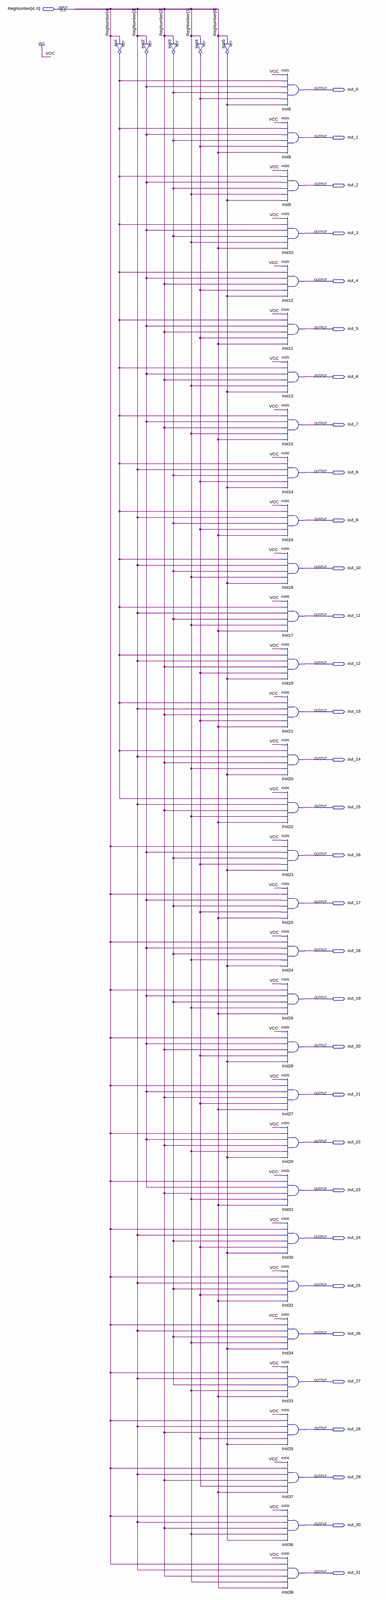
[diagram p0: schematic sheet, whole]
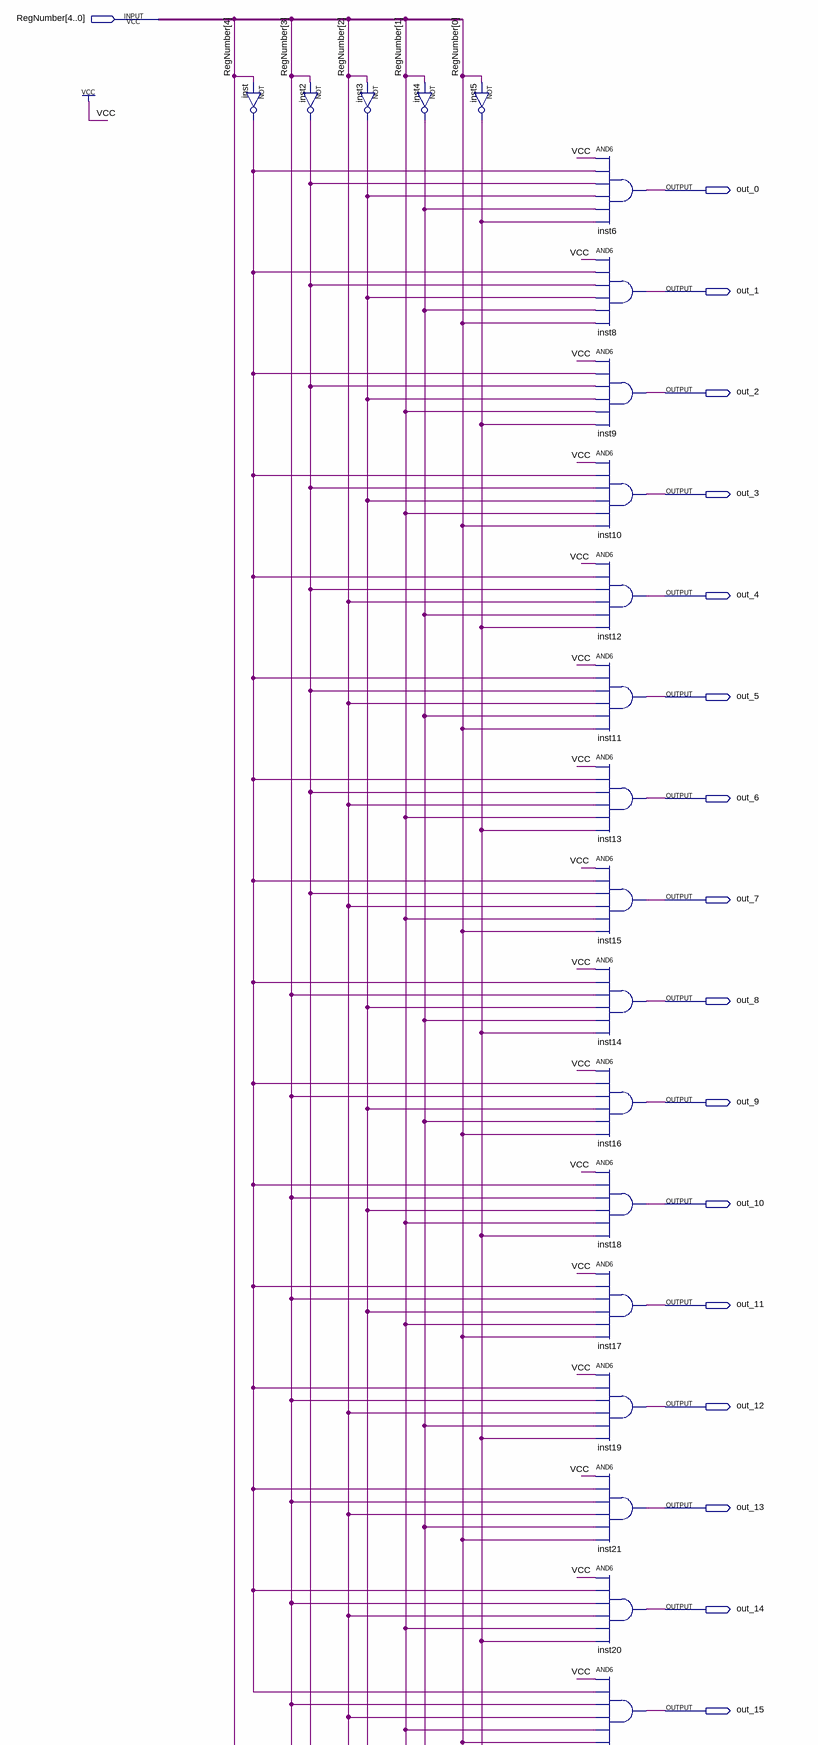
[diagram p1: schematic sheet, upper part]
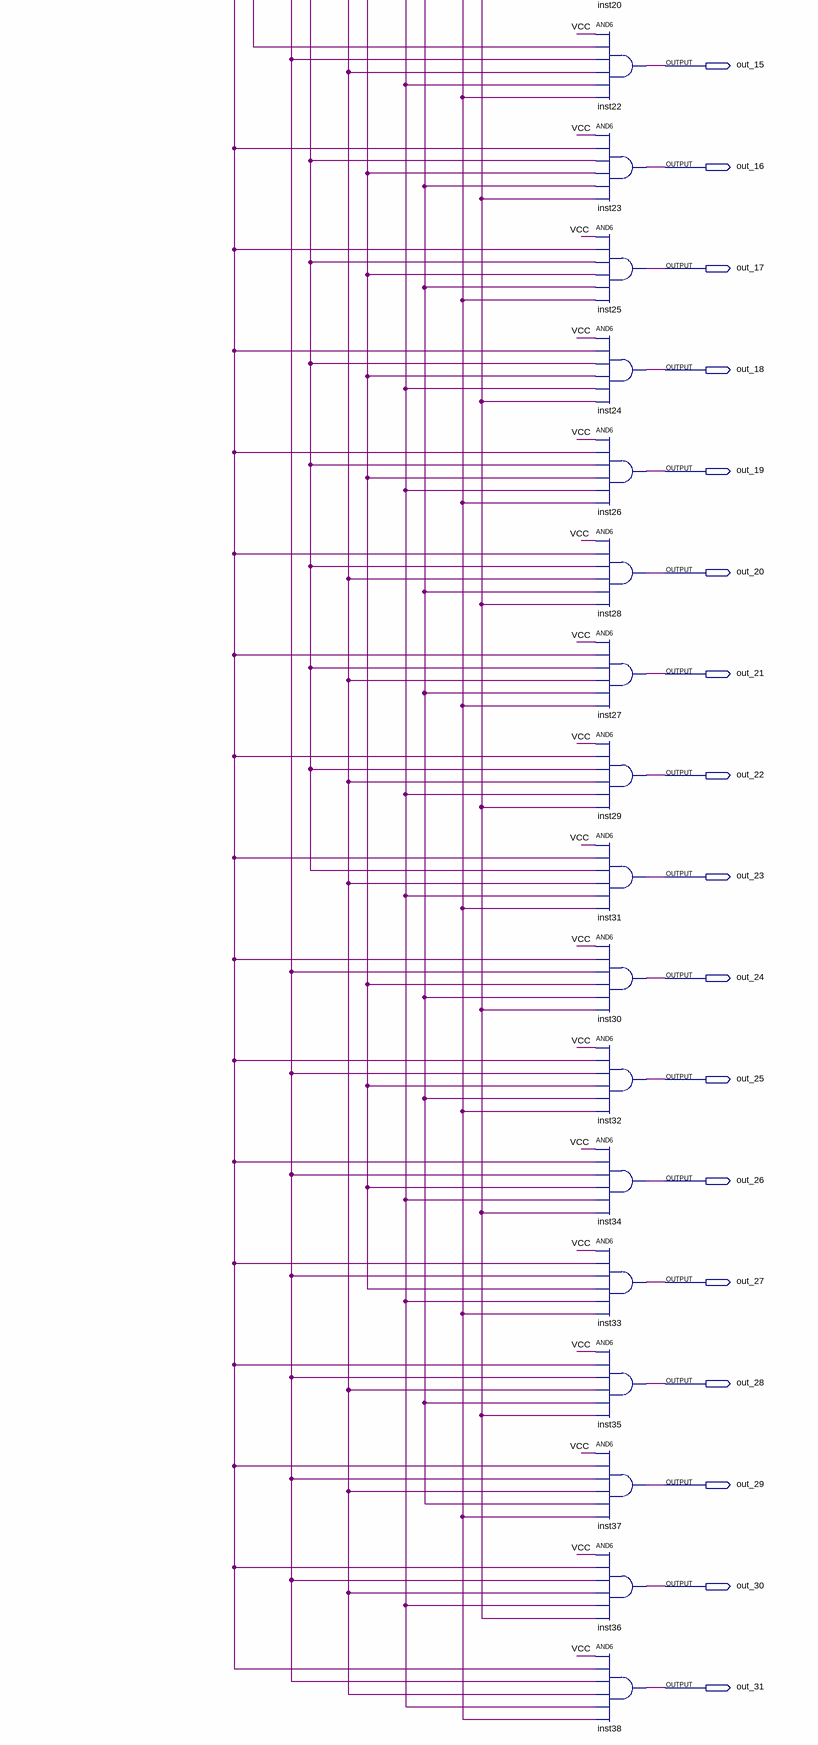
[diagram p2: schematic sheet, lower part]
// Quartus schematic Decoder_5_to_32.bdf as structural Verilog: 37 symbols, 33 pins
module Decoder_5_to_32 (
  input  [4:0] RegNumber,
  output out_0,
  output out_1,
  output out_2,
  output out_3,
  output out_4,
  output out_5,
  output out_6,
  output out_7,
  output out_8,
  output out_9,
  output out_10,
  output out_11,
  output out_12,
  output out_13,
  output out_14,
  output out_15,
  output out_16,
  output out_17,
  output out_18,
  output out_19,
  output out_20,
  output out_21,
  output out_22,
  output out_23,
  output out_24,
  output out_25,
  output out_26,
  output out_27,
  output out_28,
  output out_29,
  output out_30,
  output out_31
);

  wire inst2_out, inst3_out, inst4_out, inst5_out, inst_out;

  not inst (inst_out, RegNumber[4]);
  not inst2 (inst2_out, RegNumber[3]);
  not inst3 (inst3_out, RegNumber[2]);
  not inst4 (inst4_out, RegNumber[1]);
  not inst5 (inst5_out, RegNumber[0]);
  and inst6 (out_0, 1'b1, inst_out, inst2_out, inst3_out, inst4_out, inst5_out);
  and inst8 (out_1, 1'b1, inst_out, inst2_out, inst3_out, inst4_out, RegNumber[0]);
  and inst9 (out_2, 1'b1, inst_out, inst2_out, inst3_out, RegNumber[1], inst5_out);
  and inst10 (out_3, 1'b1, inst_out, inst2_out, inst3_out, RegNumber[1], RegNumber[0]);
  and inst12 (out_4, 1'b1, inst_out, inst2_out, RegNumber[2], inst4_out, inst5_out);
  and inst11 (out_5, 1'b1, inst_out, inst2_out, RegNumber[2], inst4_out, RegNumber[0]);
  and inst13 (out_6, 1'b1, inst_out, inst2_out, RegNumber[2], RegNumber[1], inst5_out);
  and inst15 (out_7, 1'b1, inst_out, inst2_out, RegNumber[2], RegNumber[1], RegNumber[0]);
  and inst14 (out_8, 1'b1, inst_out, RegNumber[3], inst3_out, inst4_out, inst5_out);
  and inst16 (out_9, 1'b1, inst_out, RegNumber[3], inst3_out, inst4_out, RegNumber[0]);
  and inst18 (out_10, 1'b1, inst_out, RegNumber[3], inst3_out, RegNumber[1], inst5_out);
  and inst17 (out_11, 1'b1, inst_out, RegNumber[3], inst3_out, RegNumber[1], RegNumber[0]);
  and inst19 (out_12, 1'b1, inst_out, RegNumber[3], RegNumber[2], inst4_out, inst5_out);
  and inst21 (out_13, 1'b1, inst_out, RegNumber[3], RegNumber[2], inst4_out, RegNumber[0]);
  and inst20 (out_14, 1'b1, inst_out, RegNumber[3], RegNumber[2], RegNumber[1], inst5_out);
  and inst22 (out_15, 1'b1, inst_out, RegNumber[3], RegNumber[2], RegNumber[1], RegNumber[0]);
  and inst23 (out_16, 1'b1, RegNumber[4], inst2_out, inst3_out, inst4_out, inst5_out);
  and inst25 (out_17, 1'b1, RegNumber[4], inst2_out, inst3_out, inst4_out, RegNumber[0]);
  and inst24 (out_18, 1'b1, RegNumber[4], inst2_out, inst3_out, RegNumber[1], inst5_out);
  and inst26 (out_19, 1'b1, RegNumber[4], inst2_out, inst3_out, RegNumber[1], RegNumber[0]);
  and inst28 (out_20, 1'b1, RegNumber[4], inst2_out, RegNumber[2], inst4_out, inst5_out);
  and inst27 (out_21, 1'b1, RegNumber[4], inst2_out, RegNumber[2], inst4_out, RegNumber[0]);
  and inst29 (out_22, 1'b1, RegNumber[4], inst2_out, RegNumber[2], RegNumber[1], inst5_out);
  and inst31 (out_23, 1'b1, RegNumber[4], inst2_out, RegNumber[2], RegNumber[1], RegNumber[0]);
  and inst30 (out_24, 1'b1, RegNumber[4], RegNumber[3], inst3_out, inst4_out, inst5_out);
  and inst32 (out_25, 1'b1, RegNumber[4], RegNumber[3], inst3_out, inst4_out, RegNumber[0]);
  and inst34 (out_26, 1'b1, RegNumber[4], RegNumber[3], inst3_out, RegNumber[1], inst5_out);
  and inst33 (out_27, 1'b1, RegNumber[4], RegNumber[3], inst3_out, RegNumber[1], RegNumber[0]);
  and inst35 (out_28, 1'b1, RegNumber[4], RegNumber[3], RegNumber[2], inst4_out, inst5_out);
  and inst37 (out_29, 1'b1, RegNumber[4], RegNumber[3], RegNumber[2], inst4_out, RegNumber[0]);
  and inst36 (out_30, 1'b1, RegNumber[4], RegNumber[3], RegNumber[2], RegNumber[1], inst5_out);
  and inst38 (out_31, 1'b1, RegNumber[4], RegNumber[3], RegNumber[2], RegNumber[1], RegNumber[0]);
endmodule
